# Altium schematic sheet ws2812.schdoc
size 268 x 116 mm
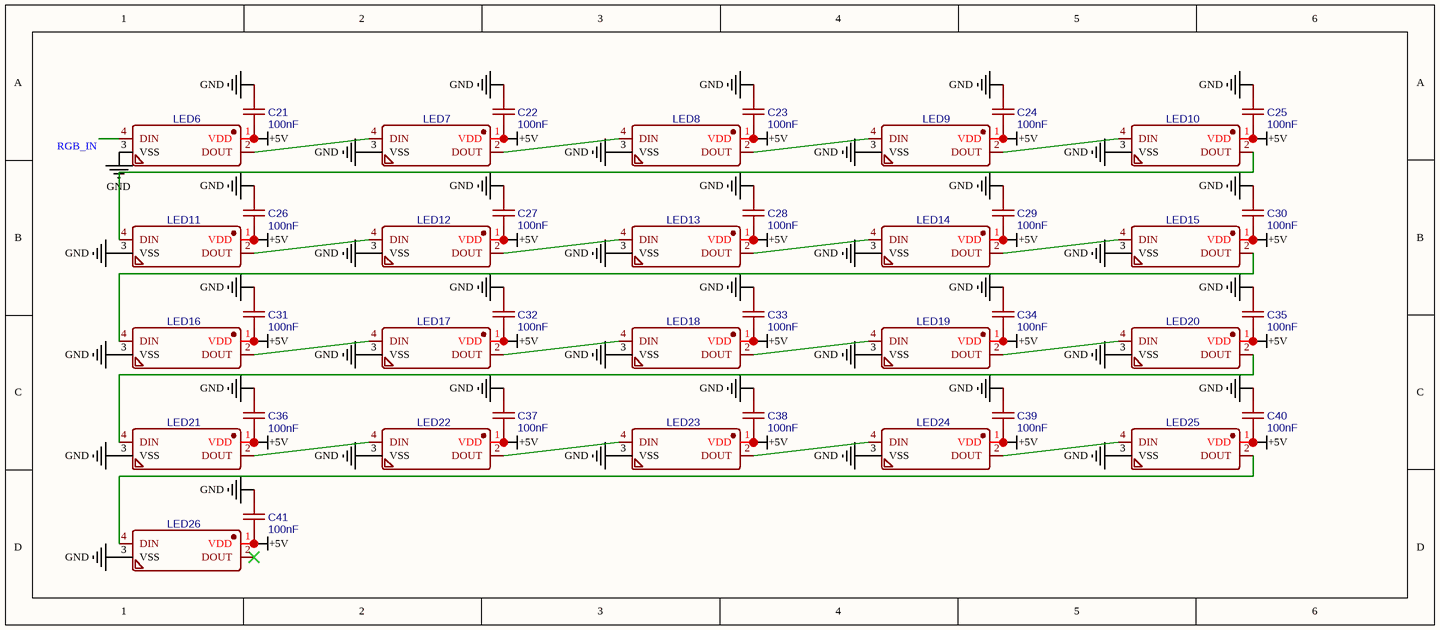
[diagram p0: ws2812.schdoc]

## Parts
C21  100nF  [C0603]
C22  100nF  [C0603]
C23  100nF  [C0603]
C24  100nF  [C0603]
C25  100nF  [C0603]
C26  100nF  [C0603]
C27  100nF  [C0603]
C28  100nF  [C0603]
C29  100nF  [C0603]
C30  100nF  [C0603]
C31  100nF  [C0603]
C32  100nF  [C0603]
C33  100nF  [C0603]
C34  100nF  [C0603]
C35  100nF  [C0603]
C36  100nF  [C0603]
C37  100nF  [C0603]
C38  100nF  [C0603]
C39  100nF  [C0603]
C40  100nF  [C0603]
C41  100nF  [C0603]
LED6  WS2812E  [LED-SMD_4P-L5.0-W5.0-TL]  (value not drawn)
LED7  WS2812E  [LED-SMD_4P-L5.0-W5.0-TL]  (value not drawn)
LED8  WS2812E  [LED-SMD_4P-L5.0-W5.0-TL]  (value not drawn)
LED9  WS2812E  [LED-SMD_4P-L5.0-W5.0-TL]  (value not drawn)
LED10  WS2812E  [LED-SMD_4P-L5.0-W5.0-TL]  (value not drawn)
LED11  WS2812E  [LED-SMD_4P-L5.0-W5.0-TL]  (value not drawn)
LED12  WS2812E  [LED-SMD_4P-L5.0-W5.0-TL]  (value not drawn)
LED13  WS2812E  [LED-SMD_4P-L5.0-W5.0-TL]  (value not drawn)
LED14  WS2812E  [LED-SMD_4P-L5.0-W5.0-TL]  (value not drawn)
LED15  WS2812E  [LED-SMD_4P-L5.0-W5.0-TL]  (value not drawn)
LED16  WS2812E  [LED-SMD_4P-L5.0-W5.0-TL]  (value not drawn)
LED17  WS2812E  [LED-SMD_4P-L5.0-W5.0-TL]  (value not drawn)
LED18  WS2812E  [LED-SMD_4P-L5.0-W5.0-TL]  (value not drawn)
LED19  WS2812E  [LED-SMD_4P-L5.0-W5.0-TL]  (value not drawn)
LED20  WS2812E  [LED-SMD_4P-L5.0-W5.0-TL]  (value not drawn)
LED21  WS2812E  [LED-SMD_4P-L5.0-W5.0-TL]  (value not drawn)
LED22  WS2812E  [LED-SMD_4P-L5.0-W5.0-TL]  (value not drawn)
LED23  WS2812E  [LED-SMD_4P-L5.0-W5.0-TL]  (value not drawn)
LED24  WS2812E  [LED-SMD_4P-L5.0-W5.0-TL]  (value not drawn)
LED25  WS2812E  [LED-SMD_4P-L5.0-W5.0-TL]  (value not drawn)
LED26  WS2812E  [LED-SMD_4P-L5.0-W5.0-TL]  (value not drawn)

## Nets
+5V: C21.2 C22.2 C23.2 C24.2 C25.2 C26.2 C27.2 C28.2 C29.2 C30.2 C31.2 C32.2 C33.2 C34.2 C35.2 C36.2 C37.2 C38.2 C39.2 C40.2 C41.2 LED6.1(VDD) LED7.1(VDD) LED8.1(VDD) LED9.1(VDD) LED10.1(VDD) LED11.1(VDD) LED12.1(VDD) LED13.1(VDD) LED14.1(VDD) LED15.1(VDD) LED16.1(VDD) LED17.1(VDD) LED18.1(VDD) LED19.1(VDD) LED20.1(VDD) LED21.1(VDD) LED22.1(VDD) LED23.1(VDD) LED24.1(VDD) LED25.1(VDD) LED26.1(VDD)
GND: C21.1 C22.1 C23.1 C24.1 C25.1 C26.1 C27.1 C28.1 C29.1 C30.1 C31.1 C32.1 C33.1 C34.1 C35.1 C36.1 C37.1 C38.1 C39.1 C40.1 C41.1 LED6.3(VSS) LED7.3(VSS) LED8.3(VSS) LED9.3(VSS) LED10.3(VSS) LED11.3(VSS) LED12.3(VSS) LED13.3(VSS) LED14.3(VSS) LED15.3(VSS) LED16.3(VSS) LED17.3(VSS) LED18.3(VSS) LED19.3(VSS) LED20.3(VSS) LED21.3(VSS) LED22.3(VSS) LED23.3(VSS) LED24.3(VSS) LED25.3(VSS) LED26.3(VSS)
RGB_IN: LED6.4(DIN)
NetLED6_2: LED6.2(DOUT) LED7.4(DIN)
NetLED7_2: LED7.2(DOUT) LED8.4(DIN)
NetLED8_2: LED8.2(DOUT) LED9.4(DIN)
NetLED9_2: LED9.2(DOUT) LED10.4(DIN)
NetLED10_2: LED10.2(DOUT) LED11.4(DIN)
NetLED11_2: LED11.2(DOUT) LED12.4(DIN)
NetLED12_2: LED12.2(DOUT) LED13.4(DIN)
NetLED13_2: LED13.2(DOUT) LED14.4(DIN)
NetLED14_2: LED14.2(DOUT) LED15.4(DIN)
NetLED15_2: LED15.2(DOUT) LED16.4(DIN)
NetLED16_2: LED16.2(DOUT) LED17.4(DIN)
NetLED17_2: LED17.2(DOUT) LED18.4(DIN)
NetLED18_2: LED18.2(DOUT) LED19.4(DIN)
NetLED19_2: LED19.2(DOUT) LED20.4(DIN)
NetLED20_2: LED20.2(DOUT) LED21.4(DIN)
NetLED21_2: LED21.2(DOUT) LED22.4(DIN)
NetLED22_2: LED22.2(DOUT) LED23.4(DIN)
NetLED23_2: LED23.2(DOUT) LED24.4(DIN)
NetLED24_2: LED24.2(DOUT) LED25.4(DIN)
NetLED25_2: LED25.2(DOUT) LED26.4(DIN)

Not connected (* = marked no-connect by the designer): LED26 2(DOUT)*

## Library data of the parts
C21-C41 = 100nF: BOM_Manufacturer: YAGEO; BOM_Manufacturer Part: CC0603KRX7R9BB104; nameAlias: Capacitance; BOM_Supplier: LCSC; BOM_Supplier Part: C14663; BOM_JLCPCB Part Class: Basic Part; spicePre: C; spiceSymbolName: CC0603KRX7R9BB104
LED6-LED26 = WS2812E: BOM_Manufacturer: Worldsemi; Contributor: LCSC; SMT Type: Extend; BOM_Supplier: LCSC; BOM_Supplier Part: C139127; BOM_Manufacturer Part: WS2812E; BOM_LCSC Assembly: Yes; spicePre: L; spiceSymbolName: WS2812E